# EAGLE schematic rc32kram62256ram_v1 (EAGLE 9.6.2)
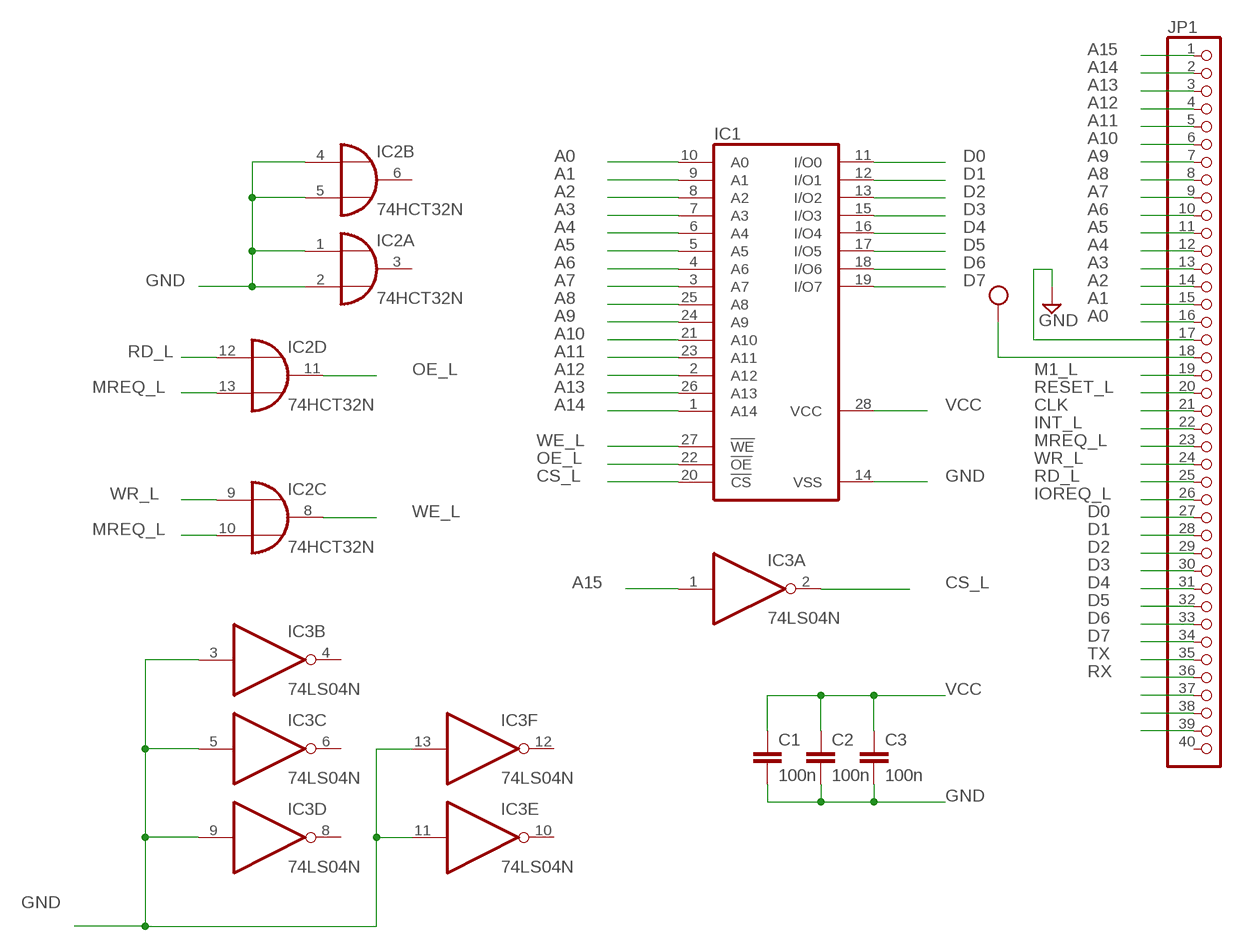
[diagram p0: schematic, sheet 1]

## Parts
C1  100n  C-EU050-025X075  [C050-025X075]
C2  100n  C-EU050-025X075  [C050-025X075]
C3  100n  C-EU050-025X075  [C050-025X075]
IC1  62256P  [DIL28-6]
IC2  74HCT32N  [DIL14]
IC3  74LS04N  [DIL14]
JP1  PINHD-1X40  [1X40]

## Nets
A0: IC1.10(A0) JP1.16
A1: IC1.9(A1) JP1.15
A2: IC1.8(A2) JP1.14
A3: IC1.7(A3) JP1.13
A4: IC1.6(A4) JP1.12
A5: IC1.5(A5) JP1.11
A6: IC1.4(A6) JP1.10
A7: IC1.3(A7) JP1.9
A8: IC1.25(A8) JP1.8
A9: IC1.24(A9) JP1.7
A10: IC1.21(A10) JP1.6
A11: IC1.23(A11) JP1.5
A12: IC1.2(A12) JP1.4
A13: IC1.26(A13) JP1.3
A14: IC1.1(A14) JP1.2
A15: IC3.1(A:I) JP1.1
CLK: JP1.21
CS_L: IC1.20(!CS) IC3.2(A:O)
D0: IC1.11(I/O0) JP1.27
D1: IC1.12(I/O1) JP1.28
D2: IC1.13(I/O2) JP1.29
D3: IC1.15(I/O3) JP1.30
D4: IC1.16(I/O4) JP1.31
D5: IC1.17(I/O5) JP1.32
D6: IC1.18(I/O6) JP1.33
D7: IC1.19(I/O7) JP1.34
GND: C1.2 C2.2 C3.2 IC1.14(VSS) IC2.1(A:I0) IC2.2(A:I1) IC2.4(B:I0) IC2.5(B:I1) IC3.3(B:I) IC3.5(C:I) IC3.9(D:I) IC3.11(E:I) IC3.13(F:I) JP1.17
INT_L: JP1.22
IOREQ_L: JP1.26
M1_L: JP1.19
MREQ_L: IC2.10(C:I1) IC2.13(D:I1) JP1.23
N$1: JP1.37
N$2: JP1.38
N$3: JP1.39
OE_L: IC1.22(!OE) IC2.11(D:O)
RD_L: IC2.12(D:I0) JP1.25
RESET_L: JP1.20
RX: JP1.36
TX: JP1.35
VCC: C1.1 C2.1 C3.1 IC1.28(VCC) JP1.18
WE_L: IC1.27(!WE) IC2.8(C:O)
WR_L: IC2.9(C:I0) JP1.24
Unconnected: IC2.3(A:O) IC2.6(B:O) IC3.4(B:O) IC3.6(C:O) IC3.8(D:O) IC3.10(E:O) IC3.12(F:O) JP1.40

## Power pins joined to a net without a drawn wire
GND: IC2.7(P:GND) IC3.7(P:GND)
VCC: IC2.14(P:VCC) IC3.14(P:VCC)

## Library data of the parts
C1-C3 = rcl:C-EU: CAPACITOR, European symbol; SPICEPREFIX: C
IC1 = memory-hitachi:62256P: MEMORY; OC_FARNELL: unknown; OC_NEWARK: unknown
IC2 = 74xx-eu:74*32: Quad 2-input OR gate
IC3 = 74xx-eu:74*04: Hex INVERTER
JP1 = pinhead:PINHD-1X40: PIN HEADER